# EAGLE design dual control board (EAGLE 6.4)
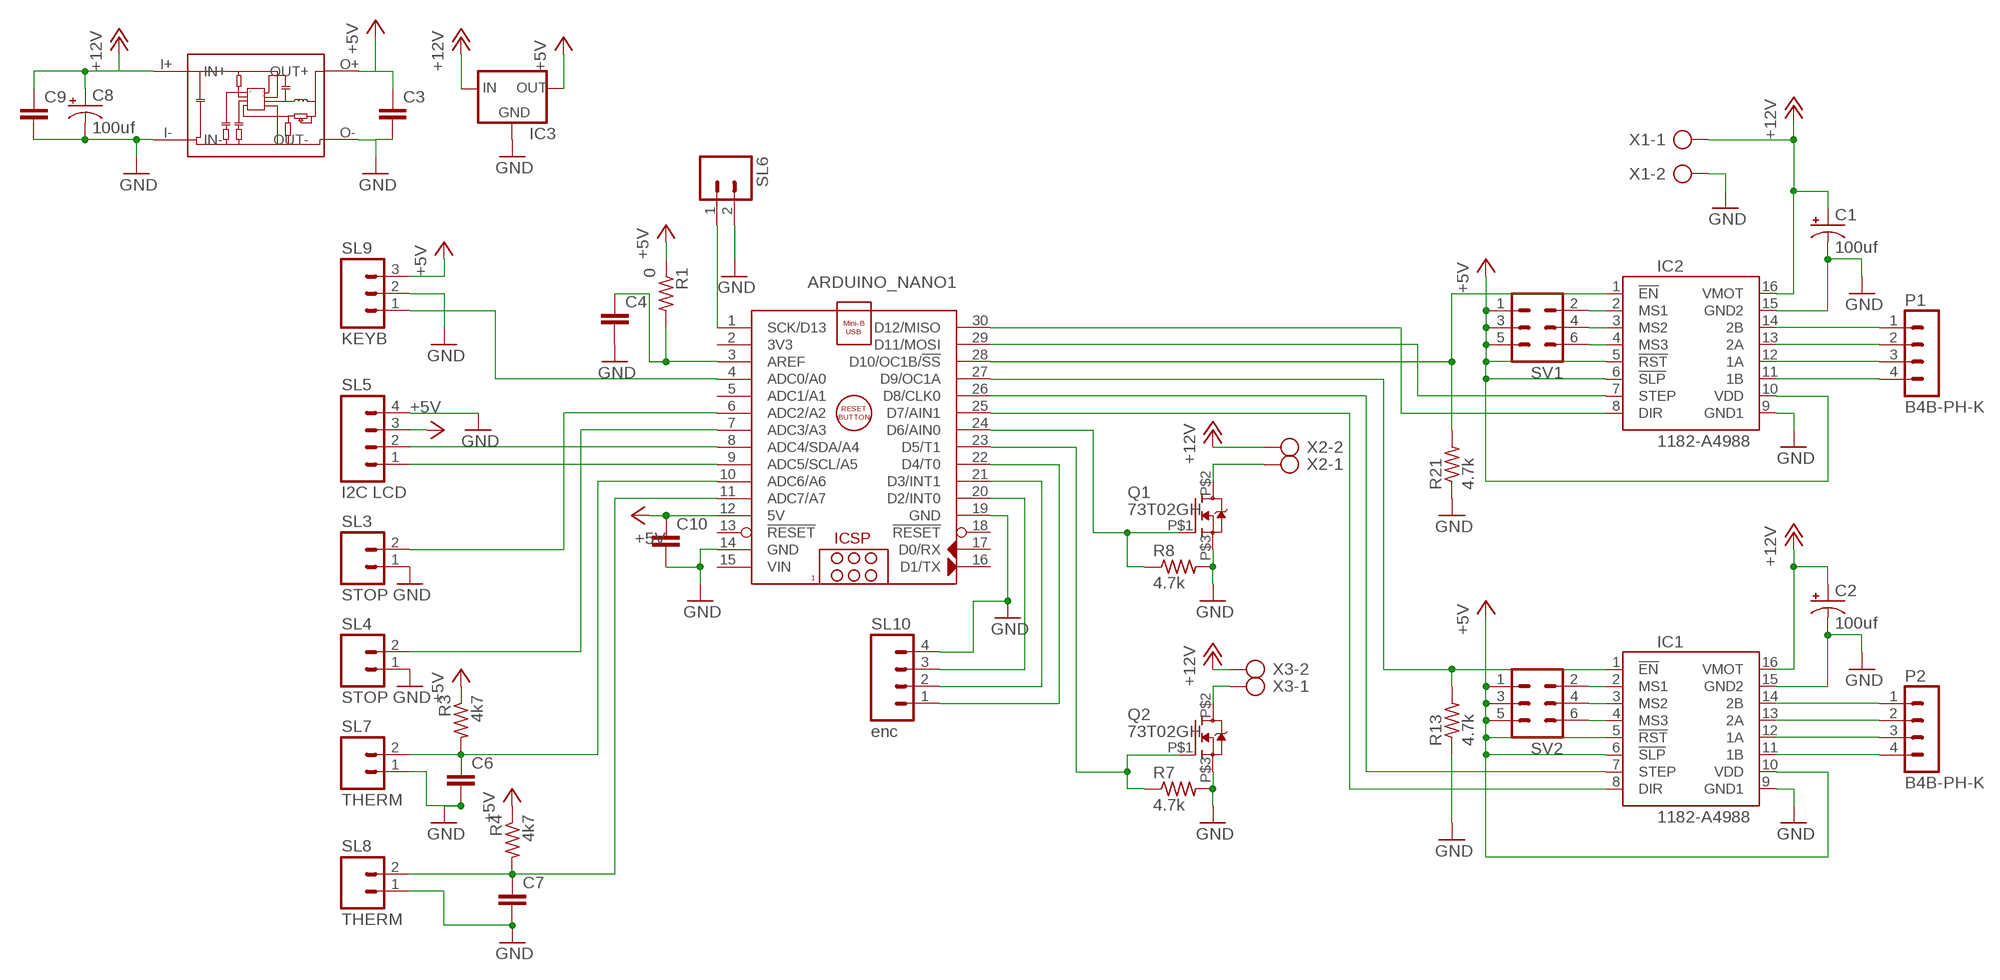
[diagram p0: schematic, sheet 1]

## Parts
ARDUINO_NANO1  ARDUINO_NANO  [ARDUINO_NANO]
C1  100uf  CPOL-USE3.5-8  [E3,5-8]
C2  100uf  CPOL-USE3.5-8  [E3,5-8]
C3  C-EU050-024X044  [C050-024X044]
C4  C-EU050-024X044  [C050-024X044]
C6  C-EU050-024X044  [C050-024X044]
C7  C-EU050-024X044  [C050-024X044]
C8  100uf  CPOL-USE3.5-8  [E3,5-8]
C9  C-EU050-024X044  [C050-024X044]
C10  C-EU050-024X044  [C050-024X044]
IC1  1182-A4988  [A4988]
IC2  1182-A4988  [A4988]
IC3  78XXL  [78XXL]
P1  B4B-PH-K  [B4B-PH-K]
P2  B4B-PH-K  [B4B-PH-K]
Q1  73T02GH  [TO252]
Q2  73T02GH  [TO252]
R1  0  R-US_0204/5  [0204/5]
R3  4k7  R-US_0204/5  [0204/5]
R4  4k7  R-US_0204/5  [0204/5]
R7  4.7k  R-US_0204/5  [0204/5]
R8  4.7k  R-US_0204/5  [0204/5]
R13  4.7k  R-US_0204/5  [0204/5]
R21  4.7k  R-US_0204/5  [0204/5]
SL3  STOP  M02  [02P]
SL4  STOP  M02  [02P]
SL5  I2C LCD  M04  [04P]
SL6  M02  [02P]
SL7  THERM  M02  [02P]
SL8  THERM  M02  [02P]
SL9  KEYB  M03  [03P]
SL10  enc  M04  [04P]
SV1  MA03-2  [MA03-2]
SV2  MA03-2  [MA03-2]
U$1  MINI360  [MINI360]
X1  AK500/2  [AK500/2]
X2  AK500/2  [AK500/2]
X3  AK500/2  [AK500/2]

## Nets
+5V: ARDUINO_NANO1.12(5V) C3.1 C10.1 IC1.5(!RST) IC1.6(!SLP) IC1.10(VDD) IC2.5(!RST) IC2.6(!SLP) IC2.10(VDD) IC3.OUT R1.1 R3.1 R4.1 SL5.3 SL9.3 SV1.1 SV1.3 SV1.5 SV2.1 SV2.3 SV2.5 U$1.O+(OUT+)
+12V: C1.+ C2.+ C8.+ C9.1 IC1.16(VMOT) IC2.16(VMOT) IC3.IN U$1.I+(IN+) X1.1 X2.2 X3.2
GND: ARDUINO_NANO1.14(GND) ARDUINO_NANO1.19(GND) C1.- C2.- C3.2 C4.2 C6.2 C7.2 C8.- C9.2 C10.2 IC1.9(GND1) IC1.15(GND2) IC2.9(GND1) IC2.15(GND2) IC3.GND Q1.P$3(S) Q2.P$3(S) R7.2 R8.2 R13.1 R21.1 SL3.1 SL4.1 SL5.4 SL6.2 SL7.1 SL8.1 SL9.2 SL10.4 U$1.I-(IN-) U$1.O-(OUT-) X1.2
N$1: ARDUINO_NANO1.9(ADC5/SCL/A5) SL5.1
N$2: ARDUINO_NANO1.8(ADC4/SDA/A4) SL5.2
N$3: ARDUINO_NANO1.23(D5/T1) Q2.P$1(G) R7.1
N$4: ARDUINO_NANO1.6(ADC2/A2) SL3.2
N$5: ARDUINO_NANO1.24(D6/AIN0) Q1.P$1(G) R8.1
N$6: ARDUINO_NANO1.4(ADC0/A0) SL9.1
N$7: ARDUINO_NANO1.3(AREF) C4.1 R1.2
N$8: IC2.14(2B) P1.1
N$9: IC2.13(2A) P1.2
N$10: IC2.12(1A) P1.3
N$11: IC2.11(1B) P1.4
N$12: IC1.14(2B) P2.1
N$13: IC1.13(2A) P2.2
N$14: IC1.12(1A) P2.3
N$15: IC1.11(1B) P2.4
N$16: ARDUINO_NANO1.7(ADC3/A3) SL4.2
N$17: ARDUINO_NANO1.10(ADC6/A6) C6.1 R3.2 SL7.2
N$18: Q1.P$2(D) X2.1
N$19: Q2.P$2(D) X3.1
N$20: ARDUINO_NANO1.11(ADC7/A7) C7.1 R4.2 SL8.2
N$21: IC1.2(MS1) SV2.2
N$22: IC2.2(MS1) SV1.2
N$23: ARDUINO_NANO1.28(D10/OC1B/!SS) IC2.1(!EN) R21.2
N$24: IC2.3(MS2) SV1.4
N$25: ARDUINO_NANO1.25(D7/AIN1) IC1.8(DIR)
N$26: ARDUINO_NANO1.26(D8/CLK0) IC1.7(STEP)
N$27: ARDUINO_NANO1.27(D9/OC1A) IC1.1(!EN) R13.2
N$28: IC2.4(MS3) SV1.6
N$29: ARDUINO_NANO1.1(SCK/D13) SL6.1
N$30: ARDUINO_NANO1.30(D12/MISO) IC2.8(DIR)
N$31: ARDUINO_NANO1.20(D2/INT0) SL10.3
N$32: ARDUINO_NANO1.22(D4/T0) SL10.1
N$35: ARDUINO_NANO1.29(D11/MOSI) IC2.7(STEP)
N$36: ARDUINO_NANO1.21(D3/INT1) SL10.2
N$38: IC1.3(MS2) SV2.4
N$40: IC1.4(MS3) SV2.6
Unconnected: ARDUINO_NANO1.2(3V3) ARDUINO_NANO1.5(ADC1/A1) ARDUINO_NANO1.13(!RESET) ARDUINO_NANO1.16(D1/TX) ARDUINO_NANO1.17(D0/RX) ARDUINO_NANO1.18(!RESET)

## Power pins joined to a net without a drawn wire
VIN: ARDUINO_NANO1.15(VIN)

## Library data of the parts
ARDUINO_NANO1 = ArduinoNanoV30:ARDUINO_NANO: Arduino Nano V3.0 Module Overview: The Arduino Nano is a small, complete, and breadboard-friendly board based on the ATmega328 (Arduino Nano 3.x) or ATmega168 (Arduino Nano 2.x). It has more or less the same functionality of the Arduino Duemilanove, but in a different package. It lacks only a DC power jack, and works with a Mini-B USB cable instead of a standard one. The Nano was designed and is being produced by Gravitech <http://www.gravitech.us/arna30wiatp.html>. General specifications: Item Value Microcontroller Atmel ATmega168 or ATmega328 Operating Voltage (logic level) 5 V Input Voltage (recommended) 7-12 V Input Voltage (limits) 6-20 V Digital I/O Pins 14 (of which 6 provide PWM output) Analog Input Pins 8 DC Current per I/O Pin 40 mA Flash Memory 16 KB (ATmega168) or 32 KB (ATmega328) of which 2 KB used by bootloader SRAM 1 KB (ATmega168) or 2 KB (ATmega328) EEPROM 512 bytes (ATmega168) or 1 KB (ATmega328) Clock Speed 16 MHz Dimensions (Inches) 0.73" x 1.70" Dimensions (mm) 18mm x 45mm Overall height About 9 mm (not including pins) Weigth 5 g Power: The Arduino Nano can be powered via the Mini-B USB connection, 6-20V unregulated external power supply (pin 30), or 5V regulated external power supply (pin 27). The power source is automatically selected to the highest voltage source. Memory: The ATmega168 has 16 KB of flash memory for storing code (of which 2 KB is used for the bootloader); the ATmega328 has 32 KB, (also with 2 KB used for the bootloader). The ATmega168 has 1 KB of SRAM and 512 bytes of EEPROM (which can be read and written with the EEPROM library); the ATmega328 has 2 KB of SRAM and 1 KB of EEPROM. Input and Output: Each of the 14 digital pins on the Nano can be used as an input or output, using pinMode(), digitalWrite(), and digitalRead() functions. They operate at 5 volts. Each pin can provide or receive a maximum of 40 mA and has an internal pull-up resistor (disconnected by default) of 20-50 kOhms. In addition, some pins have specialized functions. Visit Arduino - ArduinoBoardNano <https://www.arduino.cc/en/Main/ArduinoBoardNano>
C1 C2 C8 = rcl:CPOL-US: POLARIZED CAPACITOR, American symbol
C3 C4 C6 C7 C9 C10 = rcl:C-EU: CAPACITOR, European symbol
IC1 IC2 = pololu-stepper-driver:1182-A4988: A4988 Stepper Motor Driver Carrier #1182 A4988 Stepper Motor Driver Carrier <https://www.pololu.com/product/1182> in Japan, Suzaku Lab. Ltd. <https://suzakugiken.jp/> #1182 A4988ステッピングモータドライバ <https://szc.jp/po1182>
IC3 = v-reg:78XXL: VOLTAGE REGULATOR
P1 P2 = con-jst-ph:B4B-PH-K: HEADER
Q1 Q2 = DANTE:73T02GH: 73T02GH Datasheet PDF – 25V, 57A, N-Ch, MOSFET
R1 R3 R4 R7 R8 R13 R21 = rcl:R-US_: RESISTOR, American symbol
SL3 SL4 SL6-SL8 = con-amp-quick:M02: AMP QUICK CONNECTOR; OC_FARNELL: unknown; OC_NEWARK: unknown
SL5 SL10 = con-amp-quick:M04: AMP QUICK CONNECTOR; OC_FARNELL: unknown; OC_NEWARK: unknown
SL9 = con-amp-quick:M03: AMP QUICK CONNECTOR; OC_FARNELL: unknown; OC_NEWARK: unknown
SV1 SV2 = con-lstb:MA03-2: PIN HEADER; OC_FARNELL: unknown; OC_NEWARK: unknown
U$1 = DANTE:MINI360: MP2307 Buck Converter Features Claimed specification Input voltage: 4.75-23V Output voltage: 1-17V, adjustable Size: 17mm x 11mm x 4mm Max. output current: 1.8A Additional information Starts working at about 5 V input 4-15mA idle current Adjusting the voltage is very fiddly The output voltage needs to be at least 2V below the input voltage MP2307DN buck converter chip No thermal vias under the switching the IC
X1-X3 = con-ptr500:AK500/2: CONNECTOR; OC_FARNELL: unknown; OC_NEWARK: unknown

## Board
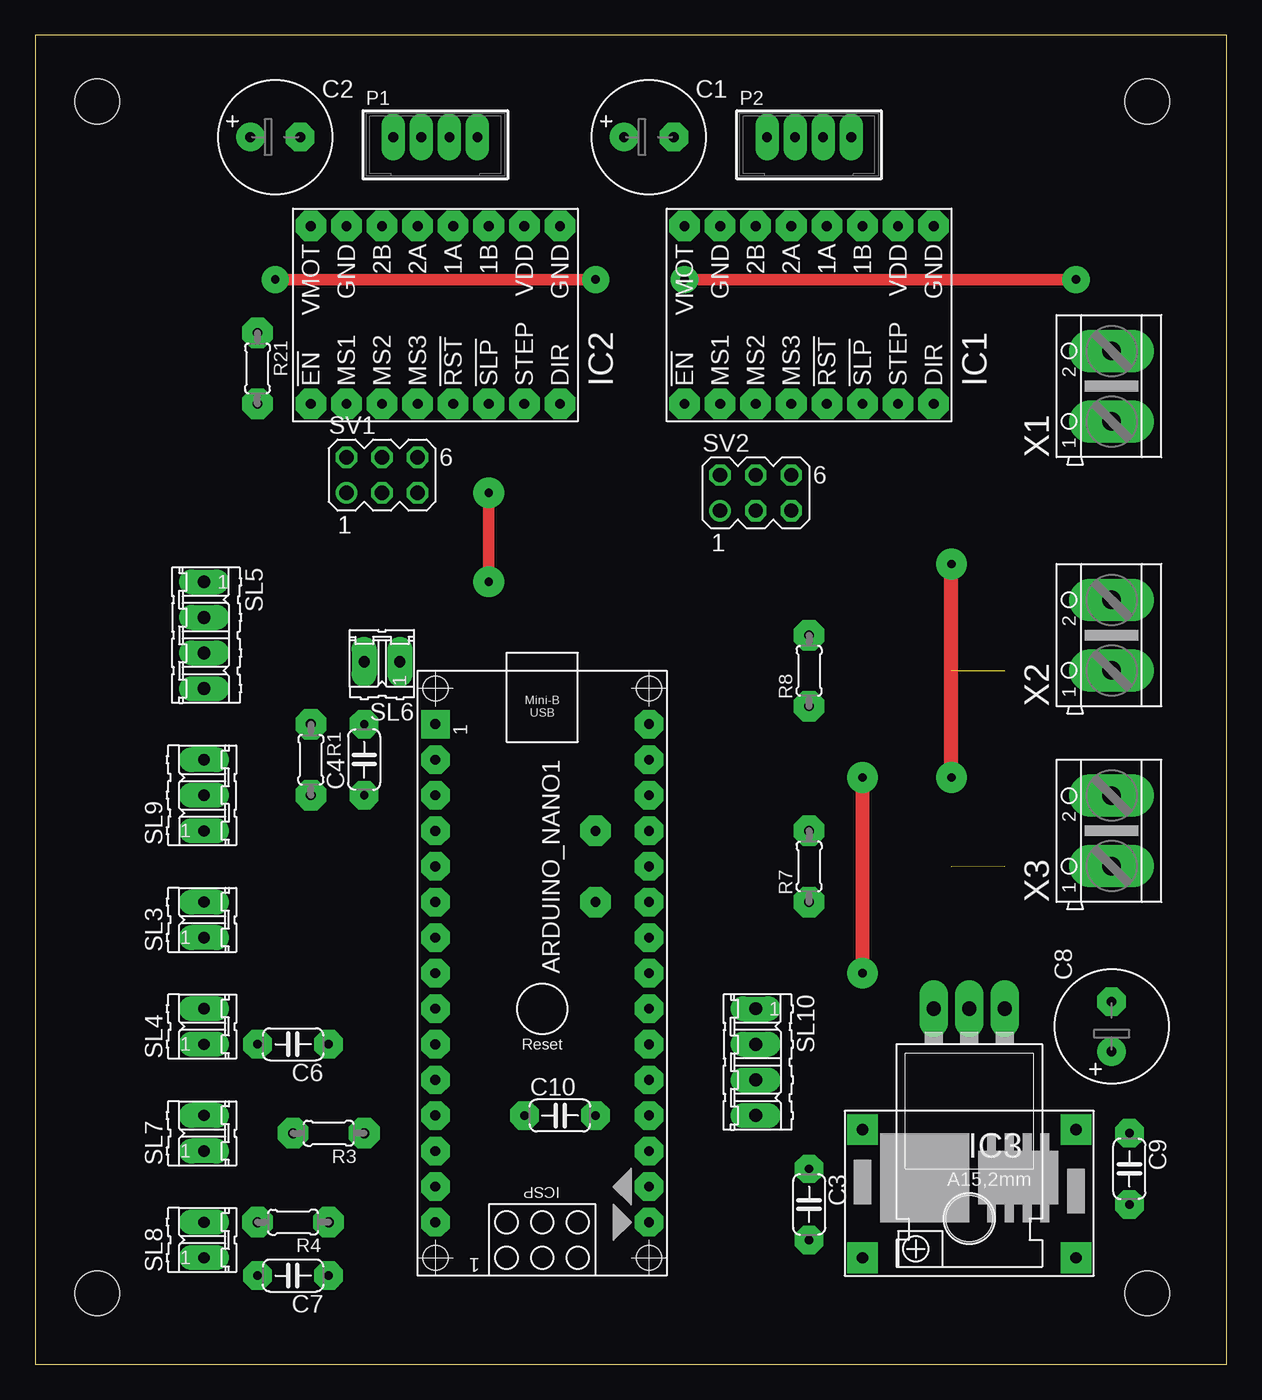
[diagram p1: board, top side]
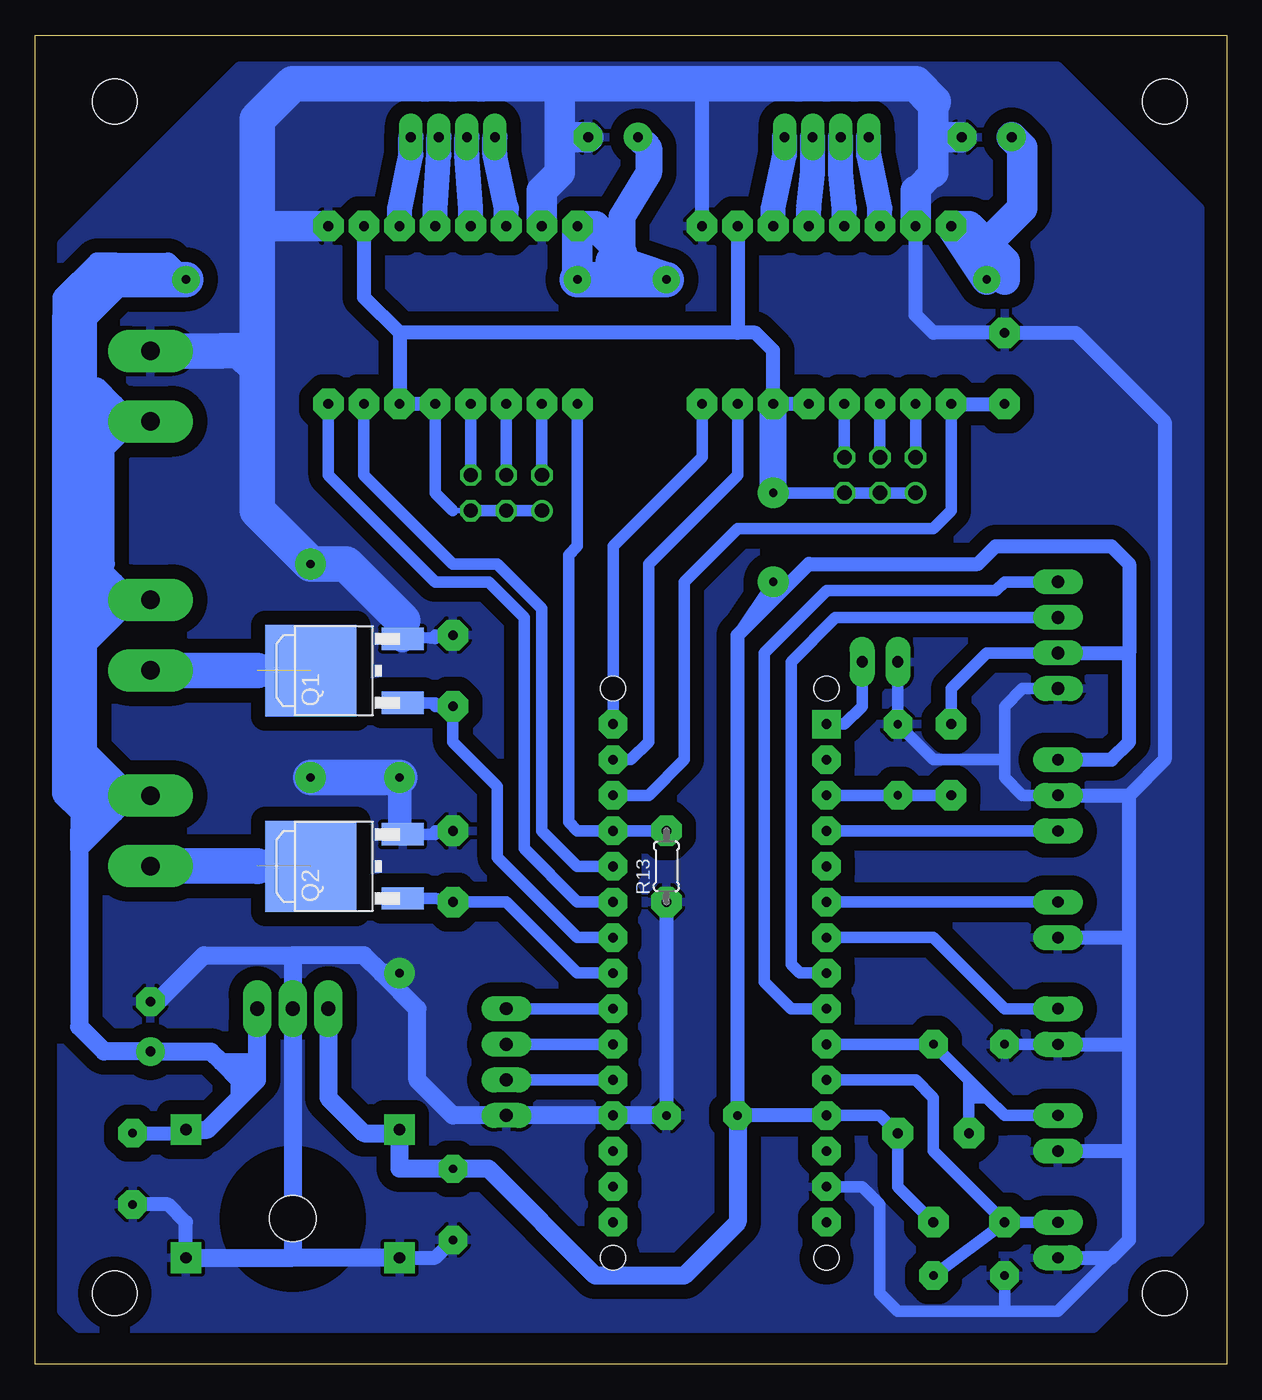
[diagram p2: board, bottom side, seen from below]

Size 85.07 x 94.92 mm. Coordinates in mm from the lower left corner, seen from the top.
Outline: 0,0 85.07,0 85.07,94.92 0,94.92 0,0
Copper layers (1*16): Top 0.035mm / dielectric 1.5mm / Bottom 0.035mm
Design rules "default": minimum track width 10mil, minimum drill 24mil, track to track 8mil, track to pad 8mil, pad to pad 8mil, via to via 8mil, smd to smd 8mil, copper to edge 40mil, drill to drill 8mil, minimum pad ring 10mil, minimum via ring 8mil, stop-mask expansion 4mil, vias tented up to drill 0mil, thermal gap 10mil
Holes 3.2 mm at 4.45,90.17 79.38,90.17 4.45,5.08 79.38,5.08

### Footprints (pad centres in the part's own frame; a part is rotated, then mirrored left to right if it is on the bottom)
ARDUINO_NANO = drill 0.7 pad 2.032 square: 1 -20.32,-7.62 | drill 0.7 pad 2.032 octagon: 2 -17.78,-7.62; 3 -15.24,-7.62; 4 -12.7,-7.62; 5 -10.16,-7.62; 6 -7.62,-7.62; 7 -5.08,-7.62; 8 -2.54,-7.62; 9 0,-7.62; 10 2.54,-7.62; 11 5.08,-7.62; 12 7.62,-7.62; 13 10.16,-7.62; 14 12.7,-7.62; 15 15.24,-7.62; 16 15.24,7.62; 17 12.7,7.62; 18 10.16,7.62; 19 7.62,7.62; 20 5.08,7.62; 21 2.54,7.62; 22 0,7.62; 23 -2.54,7.62; 24 -5.08,7.62; 25 -7.62,7.62; 26 -10.16,7.62; 27 -12.7,7.62; 28 -15.24,7.62; 29 -17.78,7.62; 30 -20.32,7.62 | hole 1.778: -22.86,-7.62; -22.86,7.62; 17.78,7.62; 17.78,-7.62
E3,5-8 = drill 0.7 pad 2.032: + -1.778,0 | drill 0.7 pad 2.032 octagon: - 1.778,0
C050-024X044 = drill 0.6 pad 2.032 octagon: 1 -2.54,0; 2 2.54,0
A4988 = drill 0.7 pad 2.184 octagon: 1 -6.35,8.89; 2 -6.35,6.35; 3 -6.35,3.81; 4 -6.35,1.27; 5 -6.35,-1.27; 6 -6.35,-3.81; 7 -6.35,-6.35; 8 -6.35,-8.89; 9 6.35,-8.89; 10 6.35,-6.35; 11 6.35,-3.81; 12 6.35,-1.27; 13 6.35,1.27; 14 6.35,3.81; 15 6.35,6.35; 16 6.35,8.89
78XXL = drill 1.016 pad 2.032 long: GND 0,-3.81; IN -2.54,-3.81; OUT 2.54,-3.81 | hole 3.302: 0,11.176
B4B-PH-K = drill 0.7 pad 1.676 long: 1 -3,0; 2 -1,0; 3 1,0; 4 3,0
TO252 = smd 1.6 x 2.997: P$1 -2.286,-1.499; P$3 2.286,-1.499 | smd 6.502 x 6.502: P$2 0,5.08
0204/5 = drill 0.7 pad 2.184 octagon: 1 -2.54,0; 2 2.54,0
02P = drill 0.8 pad 1.778 long: 1 -1.27,0; 2 1.27,0
04P = drill 0.914 pad 1.778 long: 1 -3.81,0; 2 -1.27,0; 3 1.27,0; 4 3.81,0
03P = drill 0.8 pad 1.778 long: 1 -2.54,0; 2 0,0; 3 2.54,0
MA03-2 = drill 1.016: 1 -2.54,-1.27 | drill 1.016 octagon: 2 -2.54,1.27; 3 0,-1.27; 4 0,1.27; 5 2.54,-1.27; 6 2.54,1.27
MINI360 = drill 0.8 pad 2.184 square: I+ 15.24,9.144; I- 15.24,0; O+ 0,9.144; O- 0,0
AK500/2 = drill 1.321 pad 3.048 long: 1 -2.515,0; 2 2.515,0

### Placement (x,y rotation side)
ARDUINO_NANO1  36.2,25.4 270 top
C1  43.81,87.63 0 top
C2  17.14,87.63 0 top
C3  55.24,11.43 270 top
C4  23.5,43.18 90 top
C6  18.41,22.86 180 top
C7  18.41,6.35 180 top
C8  76.83,24.13 90 top
C9  78.11,13.97 270 top
C10  37.47,17.78 0 top
IC1  55.24,74.93 90 top
IC2  28.57,74.93 90 top
IC3  66.67,21.59 180 top
P1  28.57,87.63 0 top
P2  55.24,87.63 0 top
Q1  60.33,49.53 90 bottom
Q2  60.33,35.56 90 bottom
R1  19.68,43.18 270 top
R3  20.95,16.51 180 top
R4  18.41,10.16 180 top
R7  55.24,35.56 90 top
R8  55.24,49.53 90 top
R13  40.01,35.56 90 bottom
R21  15.88,71.12 270 top
SL3  12.06,31.75 90 top
SL4  12.06,24.13 90 top
SL5  12.06,52.07 270 top
SL6  24.77,50.16 180 top
SL7  12.06,16.51 90 top
SL8  12.06,8.89 90 top
SL9  12.06,40.64 90 top
SL10  51.44,21.59 270 top
SV1  24.77,63.5 0 top
SV2  51.44,62.23 0 top
U$1  59.05,7.62 0 top
X1  76.83,69.85 90 top
X2  76.83,52.07 90 top
X3  76.83,38.1 90 top

### Tracks (layer width: path | path; a pad name or v marks a point on that pad's centre or on a via)
+5V  (via drill 0.6 pad 2.18)
  Top 0.813: v32.38,62.23 v32.38,55.88
  Bottom 0.406: SV2.5 55.24,60.96 | 59.31,16.51 U$1.O+
  Bottom 0.813: SV1.1 SV1.3 SV1.5 v32.38,62.23 | 55.24,60.96 56.52,62.23 IC1.5 | SV2.1 SV2.3 SV2.5 | R4.1 23.5,12.7 R3.1 24.77,17.78 ARDUINO_NANO1.12 | R1.1 19.68,48.26 17.14,50.8 SL5.3 | v32.38,55.88 34.92,52.07
  Bottom 1.016: SL5.3 6.99,50.8 | ARDUINO_NANO1.12 C10.1 34.92,52.07 29.84,57.15 17.78,57.15 16.51,58.42 8.26,58.42 6.99,57.15 6.99,50.8 | SL9.3 8.26,43.18 6.99,44.45 6.99,50.8 | IC1.10 61.59,76.2 59.05,73.66 | 59.05,73.66 IC1.6 IC1.5 | IC2.10 34.92,73.66 | 34.92,73.66 59.05,73.66 | 34.92,73.66 33.66,73.66 32.38,72.39 IC2.6 IC2.5
  Bottom 1.27: C10.1 34.92,10.16 38.73,6.35 45.09,6.35 52.7,13.97 C3.1 59.05,13.97 U$1.O+ | IC3.OUT 64.14,19.05 61.59,16.51 59.31,16.51
  Bottom 1.93: v32.38,62.23 IC2.6
+12V  (via drill 0.6 pad 1.93)
  Top 0.813: v74.3,77.47 v46.35,77.47 | v40.01,77.47 v17.14,77.47
  Bottom 0.406: 74.55,16.51 U$1.I+ | 81.89,40.62 81.92,40.64
  Bottom 1.016: C9.1 74.55,16.51
  Bottom 1.27: U$1.I+ 72.77,16.76 70.48,19.05 | 70.48,19.05 69.85,19.68 | 69.85,19.68 69.22,20.32 69.22,21.59 | 69.22,21.59 IC3.IN | 71.75,21.59 72.52,22.35 C8.+ 80.14,22.35 81.92,24.13 81.92,36.83 | 71.75,21.59 70.48,20.32 | 70.48,20.32 69.85,19.68 | 81.92,40.64 81.92,39.37 | 81.92,39.37 81.92,38.1 | 79.38,41.91 78.11,40.64 79.38,39.37 | 79.38,41.91 80.64,41.91 | 79.38,39.37 80.64,39.37 | 80.64,39.37 81.92,39.37 | 79.38,68.58 78.11,67.31 79.38,66.04 | 79.38,66.04 80.64,66.04 | 79.38,66.04 80.01,65.41 | 80.01,65.41 81.92,63.5 | 79.38,68.58 80.64,68.58 81.92,69.85 | 79.38,68.58 80.64,69.85 | 79.38,55.88 78.11,54.61 79.38,53.34 | 79.38,55.88 80.64,55.88 | 79.38,53.34 80.64,53.34 | 79.38,55.88 81.92,58.42 | 79.38,53.34 81.92,50.8 | 79.38,41.91 81.92,44.45 | 81.92,39.37 83.19,40.64 83.19,74.93 | 83.19,74.93 79.38,78.74 | 79.38,78.74 75.56,78.74 v74.3,77.47 | 79.38,39.37 81.92,36.83 | 81.92,36.83 81.92,38.1 | 81.92,38.1 80.64,39.37 | 71.75,21.59 69.22,21.59 | 69.22,21.59 70.48,20.32 | 70.48,20.32 70.48,19.05 | 80.01,57.15 80.01,65.41 | 79.38,78.74 80.64,78.74 83.19,76.2 83.19,74.93
  Bottom 1.93: C1.+ 41.27,86.87 41.27,85.09 43.18,81.92 43.18,79.38
  Bottom 2.184: v17.14,77.47 IC2.16 18.41,81.28 17.14,80.01 | v46.35,77.47 IC1.16 45.09,81.28 43.18,79.38 43.81,78.74 | 17.14,80.01 15.88,78.74 15.88,77.47 | C2.+ 14.61,86.87 14.61,82.55 17.14,80.01
  Bottom 2.54: X3.2 81.89,40.62 | X2.2 81.92,54.59 | 81.92,54.59 81.92,50.8 81.92,44.45 81.92,40.64 | X1.1 81.92,67.33 | 81.92,67.33 81.92,63.5 81.92,58.42 81.92,54.59 | v74.3,77.47 79.38,77.47 81.92,74.93 81.92,69.85 81.92,67.33 | v46.35,77.47 v40.01,77.47 43.81,78.74
GND  (via drill 0.6 pad 2.18)
  Top 1.016: v65.41,41.91 v65.41,57.15 | v59.05,41.91 v59.05,27.94
  Bottom 0.406: Q1.P$3 56.52,51.82 | 56.52,52.07 R8.2 | 56.52,37.85 56.52,38.1
  Bottom 0.813: 56.52,52.07 56.52,51.82 59.31,52.07 | Q2.P$3 56.52,37.85 | 56.52,38.1 R7.2 | C6.2 SL4.1 | SL9.2 14.61,40.64 15.88,41.91 15.88,43.18 | SL5.4 14.61,48.26 15.88,46.99 15.88,43.18 | SL6.2 C4.2 20.95,43.18 15.88,43.18 | ARDUINO_NANO1.14 26.04,12.7 24.77,11.43 24.77,5.08 23.5,3.81 15.88,3.81 | 15.88,3.81 12.06,3.81 8.26,7.62 | C7.2 15.88,3.81
  Bottom 1.016: SL8.1 8.26,7.62 6.99,8.89 6.99,15.24 | 6.99,15.24 6.99,22.86 | 6.99,22.86 6.99,30.48 | 6.99,30.48 6.99,40.64 | SL7.1 6.99,15.24 | SL4.1 6.99,22.86 | SL3.1 6.99,30.48 | SL9.2 6.99,40.64 | U$1.I- 74.3,10.16 75.56,11.43 C9.2 | U$1.O- 56.52,7.62 C3.2 | C8.- 76.33,25.91 | IC2.15 22.23,74.93 20.95,73.66 R21.1 10.79,73.66 4.45,67.31 4.45,43.18 6.99,40.64 | IC2.9 37.47,91.44 | 71.75,72.39 71.78,72.36 | Q2.P$3 59.05,38.08 | R13.1 C10.2
  Bottom 1.27: C10.2 ARDUINO_NANO1.19 SL10.4 55.24,17.78 57.78,20.32 57.78,25.4 60.33,27.94 | 66.67,7.62 IC3.GND 66.67,29.21 | U$1.O- 66.67,7.62 | U$1.I- 66.67,7.62 | 76.33,25.91 73.03,29.21 66.67,29.21 | 60.33,27.94 61.59,29.21 66.67,29.21 | v59.05,27.94 60.33,27.94
  Bottom 1.676: 59.05,38.08 v59.05,41.91
  Bottom 1.93: 20.95,85.09 22.23,83.82 | 58.83,53.11 Q1.P$3
  Bottom 2.184: 20.95,90.17 20.95,87.63 | 20.95,87.63 20.95,85.09 | 22.23,83.82 IC2.15 | C2.- 20.95,87.63 | IC1.9 69.22,81.28 | IC1.15 48.9,83.82 47.62,85.09 47.62,87.63 | 47.62,87.63 47.62,91.44 | C1.- 47.62,87.63
  Bottom 2.54: 69.22,71.12 69.22,81.28 69.22,88.9 66.67,91.44 47.62,91.44 37.47,91.44 22.23,91.44 20.95,90.17 | 69.22,71.12 69.22,60.96 v65.41,57.15 62.87,57.15 58.83,53.11 | 69.22,71.12 70.48,72.39 71.75,72.39 | 71.78,72.36 X1.2 | v65.41,41.91 v59.05,41.91
  pour Bottom (isolate 1.016): 81.92,2.54 9.53,2.54 1.91,10.16 1.91,82.55 12.06,92.71 70.48,92.71 83.19,80.01 83.19,3.81
N$1
  Bottom 0.813: SL5.1 15.88,55.88 16.51,55.24 28.57,55.24 33.02,50.8 33.02,27.3 31.11,25.4 ARDUINO_NANO1.9
N$2
  Bottom 0.813: SL5.2 27.94,53.34 31.11,50.16 31.11,28.57 30.48,27.94 ARDUINO_NANO1.8
N$3
  Bottom 0.813: ARDUINO_NANO1.23 46.35,27.94 51.44,33.02 R7.1 56.52,33.27 Q2.P$1
N$4
  Bottom 0.813: ARDUINO_NANO1.6 SL3.2
N$5
  Bottom 0.406: 56.52,47.24 56.52,46.99
  Bottom 0.813: ARDUINO_NANO1.24 46.35,30.48 52.07,36.2 52.07,41.27 55.24,44.45 R8.1 56.52,46.99 | Q1.P$1 56.52,47.24
N$6
  Bottom 0.813: SL9.1 ARDUINO_NANO1.4
N$7
  Bottom 0.813: ARDUINO_NANO1.3 R1.2 C4.1
N$8
  Bottom 1.778: IC2.14 24.77,82.55 25.57,86.36 P1.1
N$9
  Bottom 1.778: IC2.13 27.3,82.55 27.57,85.09 P1.2
N$10
  Bottom 1.778: IC2.12 29.84,82.55 29.57,85.09 P1.3
N$11
  Bottom 1.778: IC2.11 32.38,82.55 31.57,86.36 P1.4
N$12
  Bottom 1.778: IC1.14 51.44,82.55 52.24,86.36 P2.1
N$13
  Bottom 1.778: IC1.13 53.98,82.55 54.24,86.36 P2.2
N$14
  Bottom 1.778: IC1.12 56.52,82.55 56.24,86.36 P2.3
N$15
  Bottom 1.778: IC1.11 59.05,82.55 58.24,86.36 P2.4
N$16
  Bottom 0.813: ARDUINO_NANO1.7 20.95,30.48 15.88,25.4 SL4.2
N$17
  Bottom 0.813: SL7.2 15.88,17.78 17.14,19.05 | 17.14,19.05 18.41,19.05 | 18.41,19.05 18.41,20.32 | 18.41,20.32 C6.1 ARDUINO_NANO1.10 | R3.2 18.41,19.05 | 17.14,19.05 18.41,20.32
N$18  (1 unrouted)
  Bottom 2.54: X2.1 69.22,49.55 69.22,49.53
N$19  (1 unrouted)
  Bottom 2.54: X3.1 69.22,35.59 69.22,35.56
N$20
  Bottom 0.813: SL8.2 R4.2 | C7.1 R4.2 | ARDUINO_NANO1.11 22.23,20.32 20.95,19.05 20.95,15.24 R4.2
N$21
  Bottom 0.813: SV2.2 IC1.2
N$22
  Bottom 0.813: IC2.2 SV1.2
N$23
  Bottom 0.813: ARDUINO_NANO1.28 41.27,40.64 38.73,43.18 38.73,55.88 34.92,59.69 20.95,59.69 19.68,60.96 IC2.1
  Bottom 1.016: IC2.1 R21.2
N$24
  Bottom 0.813: IC2.3 SV1.4
N$25
  Bottom 0.813: ARDUINO_NANO1.25 46.35,33.02 50.16,36.83 50.16,53.34 52.7,55.88 56.52,55.88 64.14,63.5 IC1.8
N$26
  Bottom 0.813: IC1.7 61.59,63.5 55.24,57.15 52.07,57.15 48.9,53.98 48.9,38.1 46.35,35.56 ARDUINO_NANO1.26
N$27
  Bottom 0.813: IC1.1 46.35,58.42 46.99,57.78 46.99,38.73 46.35,38.1 ARDUINO_NANO1.27 R13.2
N$28
  Bottom 0.813: IC2.4 SV1.6
N$29
  Bottom 0.813: ARDUINO_NANO1.1 27.3,45.72 26.04,46.99 SL6.1
N$30
  Bottom 0.813: IC2.8 37.47,64.77 43.81,58.42 ARDUINO_NANO1.30
N$31
  Bottom 0.813: ARDUINO_NANO1.20 SL10.3
N$32
  Bottom 0.813: ARDUINO_NANO1.22 SL10.1
N$35
  Bottom 0.813: ARDUINO_NANO1.29 42.55,43.18 41.27,44.45 41.27,57.15 34.92,63.5 IC2.7
N$36
  Bottom 0.813: ARDUINO_NANO1.21 SL10.2
N$38
  Bottom 0.813: SV2.4 IC1.3
N$40
  Bottom 0.813: IC1.4 SV2.6